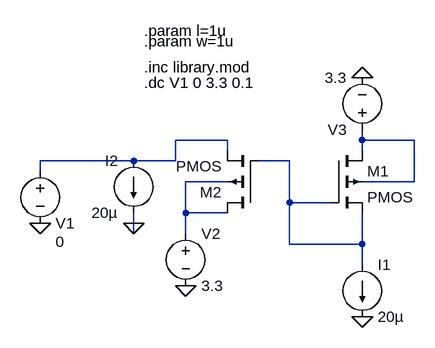
[diagram p0: schematic quiz6.asc]
quiz6.asc, the LTspice schematic file:
Version 4
SHEET 1 1304 680
WIRE 624 80 544 80
WIRE 832 80 832 64
WIRE 912 80 832 80
WIRE 624 96 624 80
WIRE 832 96 832 80
WIRE 480 112 336 112
WIRE 544 112 544 80
WIRE 544 112 480 112
WIRE 720 112 672 112
WIRE 336 128 336 112
WIRE 624 144 560 144
WIRE 912 144 912 80
WIRE 912 144 832 144
WIRE 720 176 720 112
WIRE 784 176 720 176
WIRE 560 192 560 144
WIRE 624 192 560 192
WIRE 480 208 480 192
WIRE 480 224 480 208
WIRE 560 224 560 192
WIRE 720 240 720 176
WIRE 832 240 832 192
WIRE 832 240 720 240
WIRE 832 272 832 240
FLAG 336 208 0
FLAG 480 208 0
FLAG 560 304 0
FLAG 832 352 0
FLAG 832 -16 0
SYMBOL current 480 112 M0
WINDOW 123 0 0 Left 0
WINDOW 39 0 0 Left 0
SYMATTR InstName I2
SYMATTR Value 20µ
SYMBOL voltage 336 112 R0
WINDOW 0 24 96 Left 2
WINDOW 3 24 124 Left 2
WINDOW 123 0 0 Left 0
WINDOW 39 0 0 Left 0
SYMATTR InstName V1
SYMATTR Value 0
SYMBOL pmos4 784 96 R0
SYMATTR InstName M1
SYMATTR Value2 l=l w=w
SYMBOL pmos4 672 192 R180
SYMATTR InstName M2
SYMATTR Value2 l=l w=w
SYMBOL voltage 560 208 R0
WINDOW 123 0 0 Left 0
WINDOW 39 0 0 Left 0
SYMATTR InstName V2
SYMATTR Value 3.3
SYMBOL current 832 272 R0
WINDOW 123 0 0 Left 0
WINDOW 39 0 0 Left 0
SYMATTR InstName I1
SYMATTR Value 20µ
SYMBOL voltage 832 80 R180
WINDOW 123 0 0 Left 0
WINDOW 39 0 0 Left 0
SYMATTR InstName V3
SYMATTR Value 3.3
TEXT 496 -32 Left 2 !.inc library.mod
TEXT 496 -8 Left 2 !.dc V1 0 3.3 0.1
TEXT 496 -72 Left 2 !.param w=1u
TEXT 496 -88 Left 2 !.param l=1u

The netlist it stands for:
* quiz6.asc
I2 N001 0 20µ
V1 N001 0 0
M1 N002 N003 N003 N002 PMOS l=l w=w
M2 N004 N003 N001 N004 PMOS l=l w=w
V2 N004 0 3.3
I1 N003 0 20µ
V3 N002 0 3.3
.model NMOS NMOS
.model PMOS PMOS
.lib standard.mos
.inc library.mod
.dc V1 0 3.3 0.1
.param w=1u
.param l=1u
.backanno
.end

* Results of the author's LTspice run, read from the files saved beside the schematic
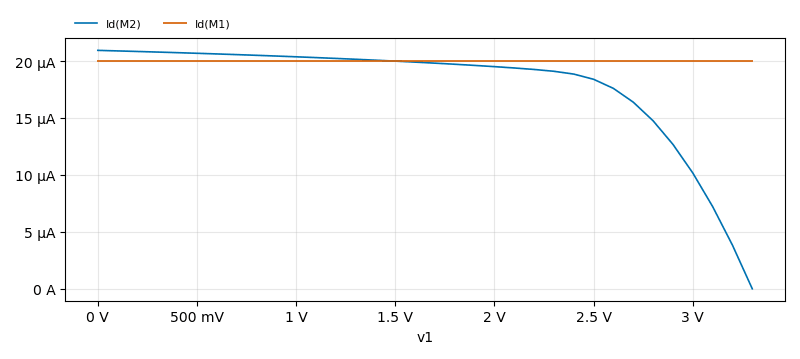
[diagram p1: DC transfer characteristic of quiz6.asc, plotted from the saved traces]
* DC transfer characteristic, 1 run:
*   Id(M2): 20.94 µA at v1=0 V, 0 A at v1=3.3 V, min 0 A, max 20.94 µA
*   Id(M1): 20 µA at v1=0 V, 20 µA at v1=3.3 V, min 20 µA, max 20 µA